# Altium schematic sheet channel.SchDoc
size A4
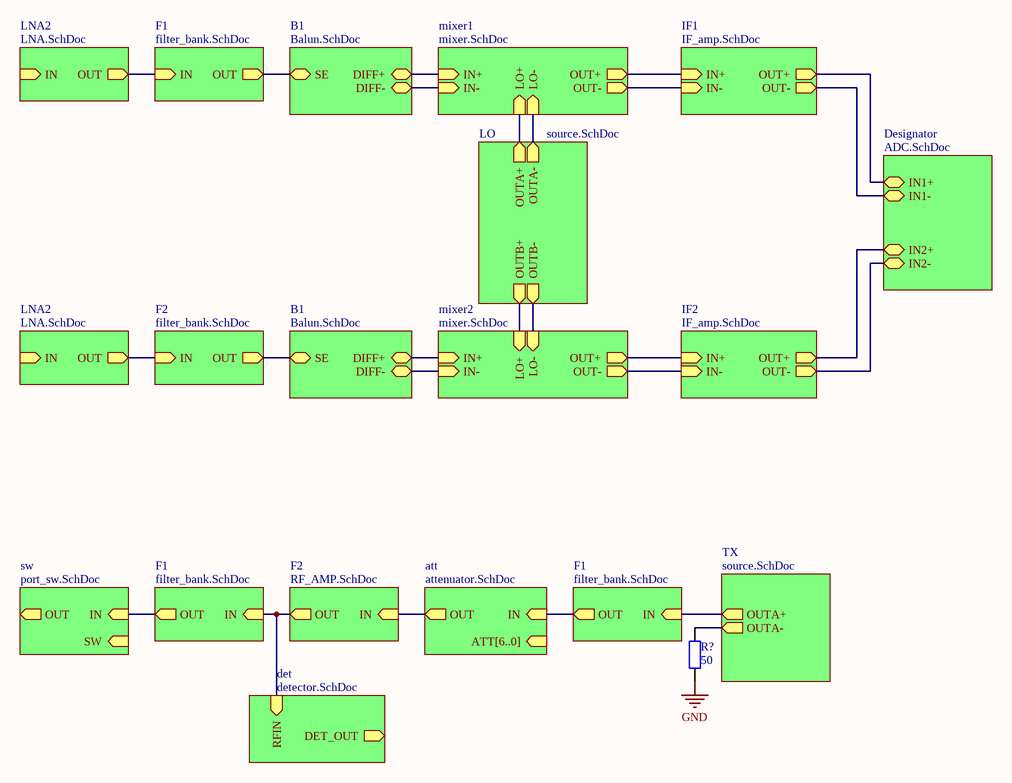
[diagram p0: channel.SchDoc]

## Parts
R?  50  [0402]

## Sub-sheets
att = attenuator.SchDoc: IN (in), OUT (out), ATT[6..0] (in)
B1 = Balun.SchDoc: SE (bidir), DIFF+ (bidir), DIFF- (bidir)
B1 = Balun.SchDoc: SE (bidir), DIFF+ (bidir), DIFF- (bidir)
Designator = ADC.SchDoc: IN1+, IN1-, IN2+, IN2-
det = detector.SchDoc: RFIN (in), DET_OUT (out)
F1 = filter_bank.SchDoc: IN (in), OUT (out)
F1 = filter_bank.SchDoc: IN (in), OUT (out)
F1 = filter_bank.SchDoc: IN (in), OUT (out)
F2 = filter_bank.SchDoc: IN (in), OUT (out)
F2 = RF_AMP.SchDoc: IN (in), OUT (out)
IF1 = IF_amp.SchDoc: IN+ (in), OUT+ (out), IN- (in), OUT- (out)
IF2 = IF_amp.SchDoc: IN+ (in), OUT+ (out), IN- (in), OUT- (out)
LNA2 = LNA.SchDoc: IN (in), OUT (out)
LNA2 = LNA.SchDoc: IN (in), OUT (out)
LO = source.SchDoc: OUTA+ (out), OUTA- (out), OUTB+ (out), OUTB- (out)
mixer1 = mixer.SchDoc: IN+ (in), IN- (in), LO+ (in), LO- (in), OUT+ (out), OUT- (out)
mixer2 = mixer.SchDoc: IN+ (in), IN- (in), LO+ (in), LO- (in), OUT+ (out), OUT- (out)
sw = port_sw.SchDoc: IN (in), OUT (out), SW (in)
TX = source.SchDoc: OUTA+ (out), OUTA- (out)

## Nets
GND: R?.2
NetR?_1: R?.1 ; sheet TX/OUTA-
(unnamed): sheet IF1/IN+, sheet mixer1/OUT+
(unnamed): sheet IF1/OUT+, sheet Designator/IN1+
(unnamed): sheet IF1/IN-, sheet mixer1/OUT-
(unnamed): sheet IF1/OUT-, sheet Designator/IN1-
(unnamed): sheet Designator/IN2+, sheet IF2/OUT+
(unnamed): sheet Designator/IN2-, sheet IF2/OUT-
(unnamed): sheet IF2/IN+, sheet mixer2/OUT+
(unnamed): sheet IF2/IN-, sheet mixer2/OUT-
(unnamed): sheet mixer1/IN+, sheet B1/DIFF+
(unnamed): sheet mixer1/IN-, sheet B1/DIFF-
(unnamed): sheet mixer1/LO+, sheet LO/OUTA+
(unnamed): sheet mixer1/LO-, sheet LO/OUTA-
(unnamed): sheet mixer2/IN+, sheet B1/DIFF+
(unnamed): sheet mixer2/IN-, sheet B1/DIFF-
(unnamed): sheet mixer2/LO+, sheet LO/OUTB+
(unnamed): sheet mixer2/LO-, sheet LO/OUTB-
(unnamed): sheet F1/IN, sheet LNA2/OUT
(unnamed): sheet F1/OUT, sheet B1/SE
(unnamed): sheet B1/SE, sheet F2/OUT
(unnamed): sheet F2/IN, sheet LNA2/OUT
(unnamed): sheet TX/OUTA+, sheet F1/IN
(unnamed): sheet F1/OUT, sheet att/IN
(unnamed): sheet F2/IN, sheet att/OUT
(unnamed): sheet F2/OUT, sheet F1/IN, sheet det/RFIN
(unnamed): sheet F1/OUT, sheet sw/IN

## Library data of the parts
R? = Res2: Resistor; Published: 8-Jun-2000; LatestRevisionDate: 17-Jul-2002; LatestRevisionNote: Re-released for DXP Platform.; PackageReference: AXIAL-0.4; Publisher: Altium Limited; PackageDescription: Axial Device, Thru-Hole; 2 Leads; 0.4 in Pin Spacing